# Altium schematic sheet 12V_Regulator.SchDoc
size A4
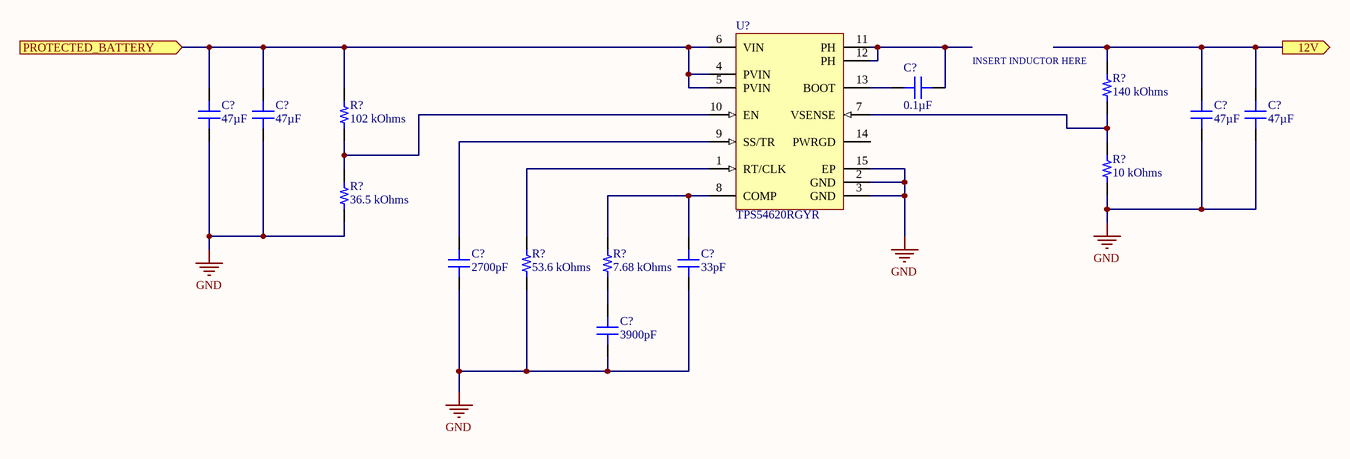
[diagram p0: 12V_Regulator.SchDoc]

## Parts
(Parts that share a designator on the sheet are numbered #1, #2 ... from top to bottom, then left to right.)
C?#1  0.1µF  [CAP 0603_1608]
C?#2  47µF  [CAP 1206_3216 - 1.8MM]
C?#3  47µF  [CAP 1206_3216 - 1.8MM]
C?#4  47µF  [CAP 1206_3216 - 1.8MM]
C?#5  47µF  [CAP 1206_3216 - 1.8MM]
C?#6  2700pF  [CAP 0603_1608]
C?#7  33pF  [CAP 0603_1608]
C?#8  3900pF  [CAP 0603_1608]
R?#1  140 kOhms  [RES 0603_1608]
R?#2  102 kOhms  [RES 0603_1608]
R?#3  10 kOhms  [RES 0603_1608]
R?#4  36.5 kOhms  [RES 0603_1608]
R?#5  53.6 kOhms  [RES 0603_1608]
R?#6  7.68 kOhms  [RES 0603_1608]
U?  TPS54620RGYR  [RHL0014A_V]

## Ports
12V (out), PROTECTED_BATTERY (in)

## Nets
GND: C?#2.1 C?#3.1 C?#4.1 C?#5.1 C?#6.1 C?#7.1 C?#8.1 R?#3.1 R?#4.1 R?#5.1 U?.2(GND) U?.3(GND) U?.15(EP)
12V: C?#4.2 C?#5.2 R?#1.2 ; port 12V
PROTECTED_BATTERY: C?#2.2 C?#3.2 R?#2.2 U?.4(PVIN) U?.5(PVIN) U?.6(VIN) ; port PROTECTED_BATTERY
NetC?#1_1: C?#1.1 U?.13(BOOT)
NetC?#1_2: C?#1.2 U?.11(PH) U?.12(PH)
NetC?#6_2: C?#6.2 U?.9(SS/TR)
NetC?#7_2: C?#7.2 R?#6.2 U?.8(COMP)
NetC?#8_2: C?#8.2 R?#6.1
NetR?#1_1: R?#1.1 R?#3.2 U?.7(VSENSE)
NetR?#2_1: R?#2.1 R?#4.2 U?.10(EN)
NetR?#5_2: R?#5.2 U?.1(RT/CLK)

Not connected (* = marked no-connect by the designer): U? 14(PWRGD)

## Notes on the sheet
- INSERT INDUCTOR HERE
- Title
- Size:
- Date:
- A4
- Number:
- Time:
- Revision:
- Sheet
- of
- File:

## Library data of the parts
C?#1 = CL10B104KB85PNL: CAP CER 0.1UF 50V X7R 0603; Manufacturer: Samsung Electro-Mechanics; Tolerance: ±10%; Part Number: CL10B104KB85PNL; Value: 0.1µF; Applications: Automotive; Capacitance: 0.1µF; ComponentLink1Description: Datasheet; ComponentLink1URL: http://www.samsungsem.com/kr/support/product-search/mlcc/CL10B104KB85PNL.jsp; ComponentLink2Description: DigiKey Link; ComponentLink2URL: http://digikey.com/product-detail/en/samsung-electro-mechanics/CL10B104KB85PNL/1276-6994-1-ND/7320636; Device Package: 0603 (1608 Metric); LastUpdated: 1/21/2020 12:01:52 AM; Lifecycle Status: Active; Minimum Order: 1; Mounting Type: Surface Mount, MLCC; Operating Temperature: -55°C ~ 125°C; Package / Case: 0603 (1608 Metric); Packaging: TapeAndReel; PartId: 13153; Part Status: Active; Price: 0.02; Ratings: AEC-Q200; Series: CL; Size / Dimension: 0.063" L x 0.031" W (1.60mm x 0.80mm); Supplier 1: DigiKey; Supplier Part Number 1: 1276-6994-1-ND; Temperature Coefficient: X7R; Thickness (Max): 0.035" (0.90mm); Voltage - Rated: 50V
C?#2-C?#5 = GRM31CR61E476ME44L: CAP CER 47UF 25V X5R 1206; Manufacturer: Murata Electronics; Tolerance: ±20%; Part Number: GRM31CR61E476ME44L; Value: 47µF; Applications: General Purpose; Capacitance: 47µF; ComponentLink2Description: DigiKey Link; ComponentLink2URL: http://digikey.com/product-detail/en/murata-electronics/GRM31CR61E476ME44L/490-16268-1-ND/7363259; Device Package: 1206 (3216 Metric); LastUpdated: 1/21/2020 12:03:34 AM; Lifecycle Status: Active; Minimum Order: 1; Mounting Type: Surface Mount, MLCC; Operating Temperature: -55°C ~ 85°C; Package / Case: 1206 (3216 Metric); Packaging: TapeAndReel; PartId: 22811; Part Status: Active; Price: 0.36; Series: GRM; Size / Dimension: 0.126" L x 0.063" W (3.20mm x 1.60mm); Supplier 1: DigiKey; Supplier Part Number 1: 490-16268-1-ND; Temperature Coefficient: X5R; Thickness (Max): 0.071" (1.80mm); Voltage - Rated: 25V
C?#6 = CL10B272KB8NNNC: CAP CER 2700PF 50V X7R 0603; Manufacturer: Samsung Electro-Mechanics; Tolerance: ±10%; Part Number: CL10B272KB8NNNC; Value: 2700pF; Applications: General Purpose; Capacitance: 2700pF; ComponentLink1Description: Datasheet; ComponentLink1URL: http://www.samsungsem.com/kr/support/product-search/mlcc/CL10B272KB8NNNC.jsp; ComponentLink2Description: DigiKey Link; ComponentLink2URL: http://digikey.com/product-detail/en/samsung-electro-mechanics/CL10B272KB8NNNC/1276-2022-1-ND/3890108; Device Package: 0603 (1608 Metric); LastUpdated: 1/21/2020 12:01:43 AM; Lifecycle Status: Active; Minimum Order: 1; Mounting Type: Surface Mount, MLCC; Operating Temperature: -55°C ~ 125°C; Package / Case: 0603 (1608 Metric); Packaging: TapeAndReel; PartId: 16107; Part Status: Active; Price: 0.01; Series: CL; Size / Dimension: 0.063" L x 0.031" W (1.60mm x 0.80mm); Supplier 1: DigiKey; Supplier Part Number 1: 1276-2022-1-ND; Temperature Coefficient: X7R; Thickness (Max): 0.035" (0.90mm); Voltage - Rated: 50V
C?#7 = CC0603JRNPO8BN330: CAP CER 33PF 25V NPO 0603; Manufacturer: Yageo; Temperature Coefficient: C0G, NP0; Tolerance: ±5%; Part Number: CC0603JRNPO8BN330; Value: 33pF; Applications: General Purpose; Capacitance: 33pF; ComponentLink1Description: Datasheet; ComponentLink1URL: https://www.yageo.com/upload/media/product/productsearch/datasheet/mlcc/UPY-GP_NP0_16V-to-50V_17.pdf; ComponentLink2Description: DigiKey Link; ComponentLink2URL: http://digikey.com/product-detail/en/yageo/CC0603JRNPO8BN330/311-3954-1-ND/8025043; Device Package: 0603 (1608 Metric); LastUpdated: 1/21/2020 12:01:58 AM; Lifecycle Status: Active; Minimum Order: 1; Mounting Type: Surface Mount, MLCC; Operating Temperature: -55°C ~ 125°C; Package / Case: 0603 (1608 Metric); Packaging: TapeAndReel; PartId: 9441; Part Status: Active; Price: 0.01; Series: CC; Size / Dimension: 0.063" L x 0.031" W (1.60mm x 0.80mm); Supplier 1: DigiKey; Supplier Part Number 1: 311-3954-1-ND; Thickness (Max): 0.035" (0.90mm); Voltage - Rated: 25V
C?#8 = CC0603KRX7R8BB392: CAP CER 3900PF 25V X7R 0603; Manufacturer: Yageo; Tolerance: ±10%; Part Number: CC0603KRX7R8BB392; Value: 3900pF; Applications: General Purpose; Capacitance: 3900pF; ComponentLink1Description: Datasheet; ComponentLink1URL: https://www.yageo.com/upload/media/product/productsearch/datasheet/mlcc/UPY-GPHC_X7R_6.3V-to-50V_18.pdf; ComponentLink2Description: DigiKey Link; ComponentLink2URL: http://digikey.com/product-detail/en/yageo/CC0603KRX7R8BB392/311-4085-1-ND/8025174; Device Package: 0603 (1608 Metric); LastUpdated: 1/21/2020 12:01:44 AM; Lifecycle Status: Active; Minimum Order: 1; Mounting Type: Surface Mount, MLCC; Operating Temperature: -55°C ~ 125°C; Package / Case: 0603 (1608 Metric); Packaging: TapeAndReel; PartId: 15737; Part Status: Active; Price: 0.01; Series: CC; Size / Dimension: 0.063" L x 0.031" W (1.60mm x 0.80mm); Supplier 1: DigiKey; Supplier Part Number 1: 311-4085-1-ND; Temperature Coefficient: X7R; Thickness (Max): 0.035" (0.90mm); Voltage - Rated: 25V
R?#1 = RMCF0603FT140K: RES 140K OHM 1% 1/10W 0603; Manufacturer: Stackpole Electronics Inc; Power (Watts): 0.1W, 1/10W; Temperature Coefficient: ±100ppm/°C; Part Number: RMCF0603FT140K; Value: 140 kOhms; ComponentLink1Description: Datasheet; ComponentLink1URL: https://www.seielect.com/catalog/sei-packaging.pdf; ComponentLink2Description: DigiKey Link; ComponentLink2URL: http://digikey.com/product-detail/en/stackpole-electronics-inc/RMCF0603FT140K/RMCF0603FT140KCT-ND/4250692; Composition: Thick Film; Device Package: 0603 (1608 Metric); Features: Automotive AEC-Q200; Height - Seated (Max): 0.022" (0.55mm); LastUpdated: 1/21/2020 12:22:36 AM; Lifecycle Status: Active; Minimum Order: 1; Number of Terminations: 2; Operating Temperature: -55°C ~ 155°C; Package / Case: 0603 (1608 Metric); Packaging: CutTape; PartId: 10763; Part Status: Active; Price: 0.10; Ratings: AEC-Q200; Resistance: 140 kOhms; Series: RMCF; Size / Dimension: 0.061" L x 0.031" W (1.55mm x 0.80mm); Supplier 1: DigiKey; Supplier Part Number 1: RMCF0603FT140KCT-ND; Supplier Device Package: 0603; Tolerance: ±1%
R?#2 = RMCF0603FT102K: RES 102K OHM 1% 1/10W 0603; Manufacturer: Stackpole Electronics Inc; Power (Watts): 0.1W, 1/10W; Temperature Coefficient: ±100ppm/°C; Part Number: RMCF0603FT102K; Value: 102 kOhms; ComponentLink1Description: Datasheet; ComponentLink1URL: https://www.seielect.com/catalog/sei-packaging.pdf; ComponentLink2Description: DigiKey Link; ComponentLink2URL: http://digikey.com/product-detail/en/stackpole-electronics-inc/RMCF0603FT102K/RMCF0603FT102KCT-ND/2417908; Composition: Thick Film; Device Package: 0603 (1608 Metric); Features: Automotive AEC-Q200; Height - Seated (Max): 0.022" (0.55mm); LastUpdated: 1/21/2020 12:22:31 AM; Lifecycle Status: Active; Minimum Order: 1; Number of Terminations: 2; Operating Temperature: -55°C ~ 155°C; Package / Case: 0603 (1608 Metric); Packaging: CutTape; PartId: 10887; Part Status: Active; Price: 0.10; Ratings: AEC-Q200; Resistance: 102 kOhms; Series: RMCF; Size / Dimension: 0.061" L x 0.031" W (1.55mm x 0.80mm); Supplier 1: DigiKey; Supplier Part Number 1: RMCF0603FT102KCT-ND; Supplier Device Package: 0603; Tolerance: ±1%
R?#3 = RNCP0603FTD10K0: RES 10K OHM 1% 1/8W 0603; Manufacturer: Stackpole Electronics Inc; Power (Watts): 0.125W, 1/8W; Temperature Coefficient: ±100ppm/°C; Part Number: RNCP0603FTD10K0; Value: 10 kOhms; ComponentLink1Description: Datasheet; ComponentLink1URL: https://www.seielect.com/catalog/sei-rncp.pdf; ComponentLink2Description: DigiKey Link; ComponentLink2URL: http://digikey.com/product-detail/en/stackpole-electronics-inc/RNCP0603FTD10K0/RNCP0603FTD10K0CT-ND/2240478; Composition: Thin Film; Device Package: 0603 (1608 Metric); Features: Anti-Sulfur, Moisture Resistant; Height - Seated (Max): 0.020" (0.50mm); LastUpdated: 1/21/2020 12:17:35 AM; Lifecycle Status: Active; Minimum Order: 1; Number of Terminations: 2; Operating Temperature: -55°C ~ 155°C; Package / Case: 0603 (1608 Metric); Packaging: TapeAndReel; PartId: 22616; Part Status: Active; Price: 0.01; Resistance: 10 kOhms; Series: RNCP; Size / Dimension: 0.059" L x 0.031" W (1.50mm x 0.80mm); Supplier 1: DigiKey; Supplier Part Number 1: RNCP0603FTD10K0CT-ND; Supplier Device Package: 0603; Tolerance: ±1%
R?#4 = RMCF0603FT36K5: RES 36.5K OHM 1% 1/10W 0603; Manufacturer: Stackpole Electronics Inc; Power (Watts): 0.1W, 1/10W; Temperature Coefficient: ±100ppm/°C; Part Number: RMCF0603FT36K5; Value: 36.5 kOhms; ComponentLink1Description: Datasheet; ComponentLink1URL: https://www.seielect.com/catalog/sei-rmcf_rmcp.pdf; ComponentLink2Description: DigiKey Link; ComponentLink2URL: http://digikey.com/product-detail/en/stackpole-electronics-inc/RMCF0603FT36K5/RMCF0603FT36K5CT-ND/1943093; Composition: Thick Film; Device Package: 0603 (1608 Metric); Features: Automotive AEC-Q200; Height - Seated (Max): 0.022" (0.55mm); LastUpdated: 1/21/2020 12:20:18 AM; Lifecycle Status: Active; Minimum Order: 1; Number of Terminations: 2; Operating Temperature: -55°C ~ 155°C; Package / Case: 0603 (1608 Metric); Packaging: CutTape; PartId: 16362; Part Status: Active; Price: 0.10; Ratings: AEC-Q200; Resistance: 36.5 kOhms; Series: RMCF; Size / Dimension: 0.061" L x 0.031" W (1.55mm x 0.80mm); Supplier 1: DigiKey; Supplier Part Number 1: RMCF0603FT36K5CT-ND; Supplier Device Package: 0603; Tolerance: ±1%
R?#5 = RMCF0603FT53K6: RES 53.6K OHM 1% 1/10W 0603; Manufacturer: Stackpole Electronics Inc; Power (Watts): 0.1W, 1/10W; Temperature Coefficient: ±100ppm/°C; Part Number: RMCF0603FT53K6; Value: 53.6 kOhms; ComponentLink1Description: Datasheet; ComponentLink1URL: https://www.seielect.com/catalog/sei-rmcf_rmcp.pdf; ComponentLink2Description: DigiKey Link; ComponentLink2URL: http://digikey.com/product-detail/en/stackpole-electronics-inc/RMCF0603FT53K6/RMCF0603FT53K6CT-ND/1943104; Composition: Thick Film; Device Package: 0603 (1608 Metric); Features: Automotive AEC-Q200; Height - Seated (Max): 0.022" (0.55mm); LastUpdated: 1/21/2020 12:16:54 AM; Lifecycle Status: Active; Minimum Order: 1; Number of Terminations: 2; Operating Temperature: -55°C ~ 155°C; Package / Case: 0603 (1608 Metric); Packaging: CutTape; PartId: 23477; Part Status: Active; Price: 0.10; Ratings: AEC-Q200; Resistance: 53.6 kOhms; Series: RMCF; Size / Dimension: 0.061" L x 0.031" W (1.55mm x 0.80mm); Supplier 1: DigiKey; Supplier Part Number 1: RMCF0603FT53K6CT-ND; Supplier Device Package: 0603; Tolerance: ±1%
R?#6 = RMCF0603FT7K68: RES 7.68K OHM 1% 1/10W 0603; Manufacturer: Stackpole Electronics Inc; Power (Watts): 0.1W, 1/10W; Temperature Coefficient: ±100ppm/°C; Part Number: RMCF0603FT7K68; Value: 7.68 kOhms; ComponentLink1Description: Datasheet; ComponentLink1URL: https://www.seielect.com/catalog/sei-rmcf_rmcp.pdf; ComponentLink2Description: DigiKey Link; ComponentLink2URL: http://digikey.com/product-detail/en/stackpole-electronics-inc/RMCF0603FT7K68/RMCF0603FT7K68CT-ND/4425120; Composition: Thick Film; Device Package: 0603 (1608 Metric); Features: Automotive AEC-Q200; Height - Seated (Max): 0.022" (0.55mm); LastUpdated: 1/21/2020 12:18:38 AM; Lifecycle Status: Active; Minimum Order: 1; Number of Terminations: 2; Operating Temperature: -55°C ~ 155°C; Package / Case: 0603 (1608 Metric); Packaging: CutTape; PartId: 20370; Part Status: Active; Price: 0.10; Ratings: AEC-Q200; Resistance: 7.68 kOhms; Series: RMCF; Size / Dimension: 0.061" L x 0.031" W (1.55mm x 0.80mm); Supplier 1: DigiKey; Supplier Part Number 1: RMCF0603FT7K68CT-ND; Supplier Device Package: 0603; Tolerance: ±1%
U? = CMP-0323-00054-3: Buck Step Down Regulator with 4.5 to 17 V Input and 0.8 to 15 V Output, -40 to 150 degC, 14-Pin VQFN (RGY), Green (RoHS & no Sb/Br); Manufacturer: Texas Instruments; Vout(Max)(V): 15; Vout(Min)(V): 0.8; Rating: Catalog; Vin(Min)(V): 4.5; Iq(Typ)(mA): 0.6; SubFamily: Step-Down Regulator; Synchronous Rectification: TRUE; Regulated Outputs(#): 1; Switch Current Limit(Typ)(A): 8; Iout(Max)(A): 6; Duty Cycle(Max)(%): 98; Vin(Max)(V): 17; Eco-Plan: Green (RoHS & no Sb/Br); PackageReference: RHL0014A; PackageVersion: revI, Jun-2011; ComponentLink2Description: Package Specification; Topology: Buck; DatasheetVersion: SLVS949C; ComponentLink3Description: URL Link1; Code_JEDEC: MO-241-BA; ComponentLink1URL: http://www.ti.com/general/docs/lit/getliterature.tsp?genericPartNumber=TPS54620&fileType=pdf; Mounting Technology: Surface Mount; ComponentLink3URL: Samples URL:http://www.ti.com/product/tps54620#samples; ComponentLink1Description: Datasheet; PartNumber: TPS54620RGYR; PackageDescription: 14-Leads Plastic Quad Flatpack No-Lead, 3.5 x 3.5 x 0.9 mm Body, 0.5 mm Pitch; ComponentLink2URL: http://www.ti.com/litv/pdf/mpqf114g